# Altium project battery_protection.PrjPcb
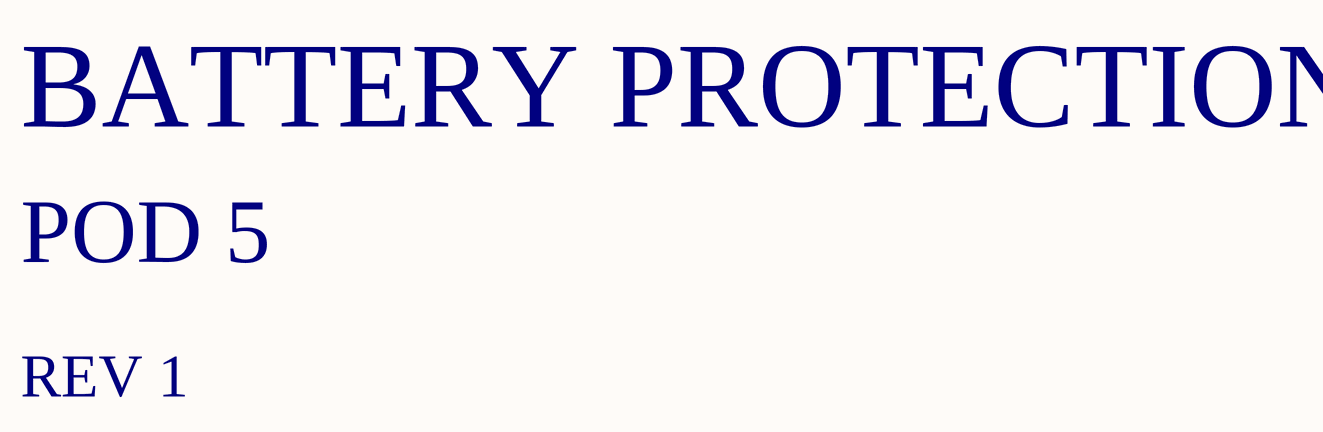
[diagram p0: battery_protection.SchDoc]
4 sheets, 24 parts. Net scope: global (net labels, ports and power ports of the same name join across sheets).
Board file: battery_protection.PcbDoc
Sheets:
  battery_protection.SchDoc
  connectors.SchDoc
  fuse.SchDoc
  cell_interface.SchDoc

## Sheet battery_protection.SchDoc: Battery Protection
size A4; Organization: Badgerloop Electrical; Address1: 133 Engineering Research Building; Address2: 1500 Engineering Drive; Address3: Madison, Wi 53706

### Notes on the sheet
- BATTERY PROTECTION
- POD 5
- REV 1
- Title
- Engineer:
- Date:
- Time:
- Revision:
- Sheet
- of
- File:

## Sheet connectors.SchDoc: Connectors
size A4; Organization: Badgerloop Electrical; Address1: 133 Engineering Research Building; Address2: 1500 Engineering Drive; Address3: Madison, Wi 53706
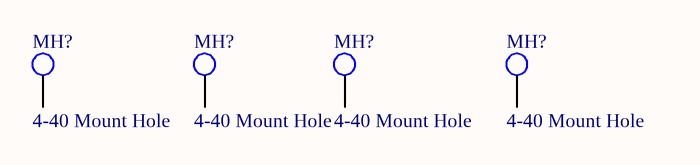
[diagram p1: connectors.SchDoc]

### Parts
(Parts that share a designator on the sheet are numbered #1, #2 ... from top to bottom, then left to right.)
MH?#1  4-40 Mount Hole  [MH]
MH?#2  4-40 Mount Hole  [MH]
MH?#3  4-40 Mount Hole  [MH]
MH?#4  4-40 Mount Hole  [MH]

### Nets

Not connected (* = marked no-connect by the designer): MH?#1 46; MH?#2 46; MH?#3 46; MH?#4 46

### Notes on the sheet
- Title
- Engineer:
- Date:
- Time:
- Revision:
- Sheet
- of
- File:

## Sheet fuse.SchDoc
size A4; Organization: Badgerloop Electrical; Address1: 133 Engineering Research Building; Address2: 1500 Engineering Drive; Address3: Madison, Wi 53706

### Notes on the sheet
- Title
- Engineer:
- Date:
- Time:
- Revision:
- Sheet
- of
- File:

## Sheet cell_interface.SchDoc: Cell Interface
size A4; Organization: Badgerloop; Address1: 133 Engineering Research; Address2: Building; Address3: Madison, WI 53715
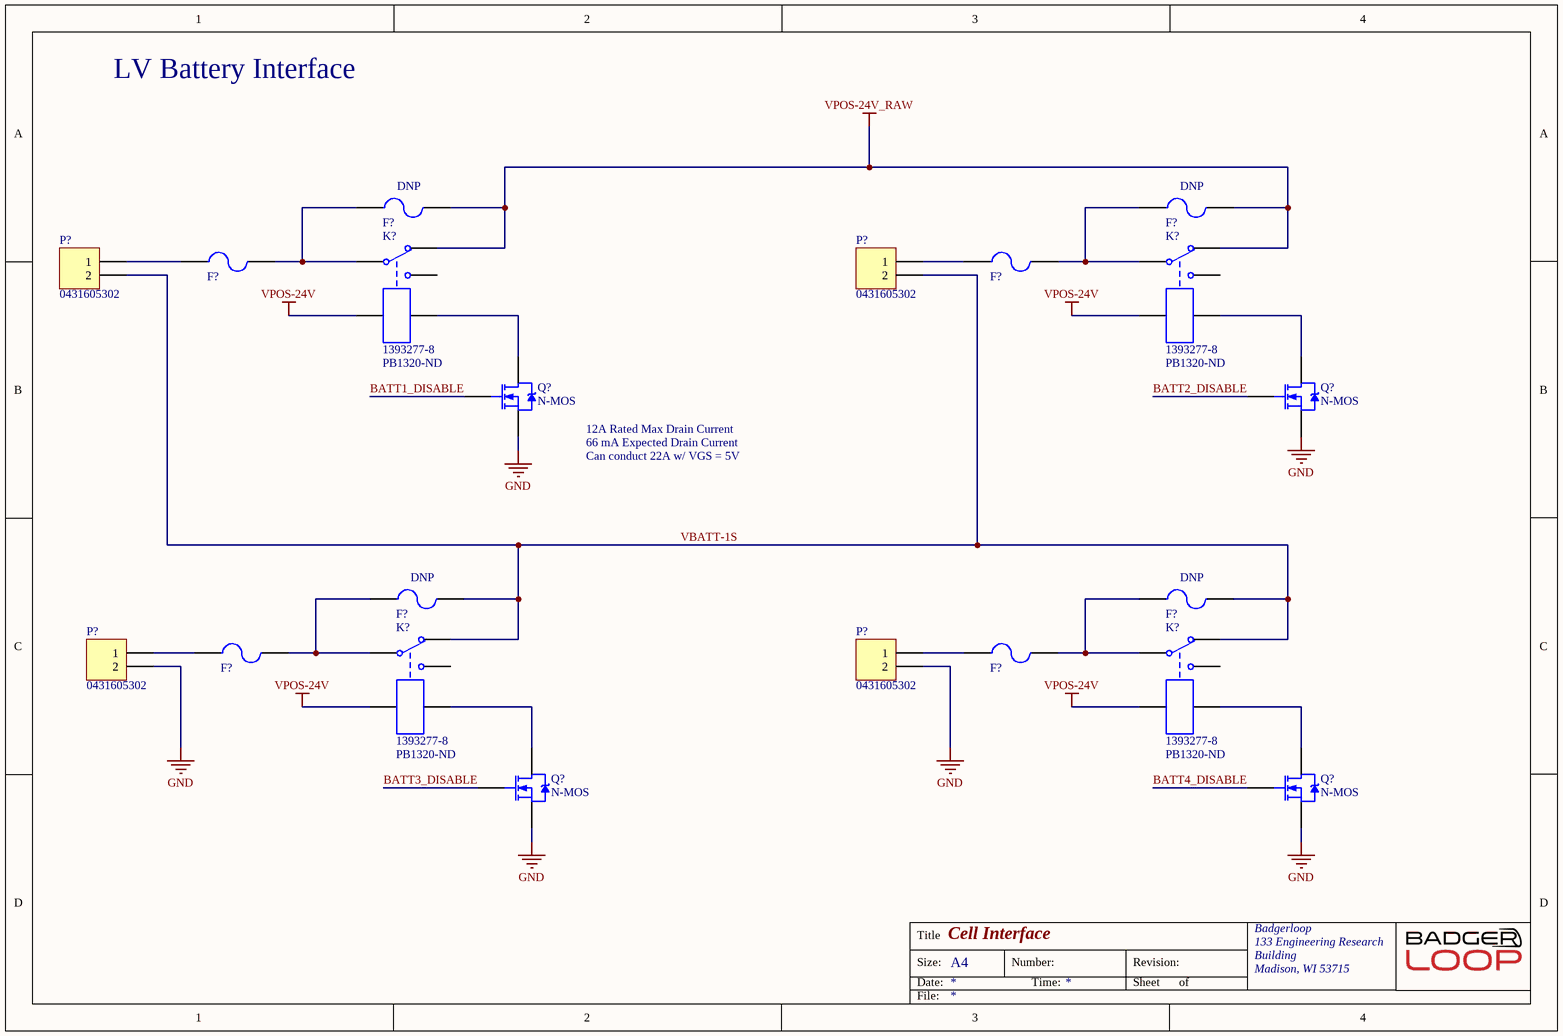
[diagram p2: cell_interface.SchDoc]

### Parts
(Parts that share a designator on the sheet are numbered #1, #2 ... from top to bottom, then left to right.)
F?#1  Do Not Populate: DNP  [Fuse Holder 30A 500V 1 Circuit Blade Through Hole]  (hidden comment: 3568)
F?#2  Do Not Populate: DNP  [Fuse Holder 30A 500V 1 Circuit Blade Through Hole]  (hidden comment: 3568)
F?#3  3568  [Fuse Holder 30A 500V 1 Circuit Blade Through Hole]  (value not drawn)
F?#4  3568  [Fuse Holder 30A 500V 1 Circuit Blade Through Hole]  (value not drawn)
F?#5  Do Not Populate: DNP  [Fuse Holder 30A 500V 1 Circuit Blade Through Hole]  (hidden comment: 3568)
F?#6  Do Not Populate: DNP  [Fuse Holder 30A 500V 1 Circuit Blade Through Hole]  (hidden comment: 3568)
F?#7  3568  [Fuse Holder 30A 500V 1 Circuit Blade Through Hole]  (value not drawn)
F?#8  3568  [Fuse Holder 30A 500V 1 Circuit Blade Through Hole]  (value not drawn)
K?#1  1393277-8  Supplier Part Number 1: PB1320-ND  [RELAY AUTOMOTIVE SPDT 45A 24V - duplicate]
K?#2  1393277-8  Supplier Part Number 1: PB1320-ND  [RELAY AUTOMOTIVE SPDT 45A 24V - duplicate]
K?#3  1393277-8  Supplier Part Number 1: PB1320-ND  [RELAY AUTOMOTIVE SPDT 45A 24V - duplicate]
K?#4  1393277-8  Supplier Part Number 1: PB1320-ND  [RELAY AUTOMOTIVE SPDT 45A 24V - duplicate]
P?#1  0431605302  [CONN HDR 2POS 7.50MM - duplicate]
P?#2  0431605302  [CONN HDR 2POS 7.50MM - duplicate]
P?#3  0431605302  [CONN HDR 2POS 7.50MM - duplicate]
P?#4  0431605302  [CONN HDR 2POS 7.50MM - duplicate]
Q?#1  N-MOS  [DPAK228P991X238-3N]
Q?#2  N-MOS  [DPAK228P991X238-3N]
Q?#3  N-MOS  [DPAK228P991X238-3N]
Q?#4  N-MOS  [DPAK228P991X238-3N]

### Nets
GND: P?#3.2 P?#4.2 Q?#1.3(S) Q?#2.3(S) Q?#3.3(S) Q?#4.3(S)
VPOS-24V: K?#1.1 K?#2.1 K?#3.1 K?#4.1
VPOS-24V_RAW: F?#1.2 F?#2.2 K?#1.3 K?#2.3
BATT1_DISABLE: Q?#1.1(G)
BATT2_DISABLE: Q?#2.1(G)
BATT3_DISABLE: Q?#3.1(G)
BATT4_DISABLE: Q?#4.1(G)
VBATT-1S: F?#5.2 F?#6.2 K?#3.3 K?#4.3 P?#1.2 P?#2.2
NetF?#1_1: F?#1.1 F?#3.2 K?#1.4
NetF?#2_1: F?#2.1 F?#4.2 K?#2.4
NetF?#3_1: F?#3.1 P?#1.1
NetF?#4_1: F?#4.1 P?#2.1
NetF?#5_1: F?#5.1 F?#7.2 K?#3.4
NetF?#6_1: F?#6.1 F?#8.2 K?#4.4
NetF?#7_1: F?#7.1 P?#3.1
NetF?#8_1: F?#8.1 P?#4.1
NetK?#1_2: K?#1.2 Q?#1.4(D)
NetK?#2_2: K?#2.2 Q?#2.4(D)
NetK?#3_2: K?#3.2 Q?#3.4(D)
NetK?#4_2: K?#4.2 Q?#4.4(D)

Not connected (* = marked no-connect by the designer): K?#1 5; K?#2 5; K?#3 5; K?#4 5

### Notes on the sheet
- LV Battery Interface
- 12A Rated Max Drain Current
- 66 mA Expected Drain Current
- Can conduct 22A w/ VGS = 5V
- Title
- Size:
- Date:
- A4
- Number:
- Time:
- Revision:
- Sheet
- of
- File:

### Library data of the parts
F?#1-F?#8 = 3568: FUSE HOLDER MINI AUTO PC; Manufacturer: Keystone Electronics; Material: Brass,Tin,Nylon; Color: Black; Body Material: Nylon; Current Rating: 20A; Voltage Rating (AC): 500V; Number of Poles: 1; Illumination Type: Illuminated; Fuse Type: Automotive; Approvals: UL; Supplier 1: Digi-Key; Manufacturer Part Number: 3568; Stock 1: 0; Mount: PCB,Vertical; Contact Material: Brass,Tin; Contact Plating: Tin; Min Operating Temperature: -50°C; Max Operating Temperature: 145°C; Package Quantity: 1; Termination: PC Pin; Orientation: Vertical; Number of Circuits: 1; Voltage: 500V; Fuse Current: 20A; Length: 16mm; Depth: 6.73mm; Lead Free: Lead Free; REACH SVHC: No SVHC; Flammability Rating: UL94 V-0; ComponentLink1URL: http://www.keyelco.com/userAssets/file/M60-2p40.pdf?src-supplier=Future+Electronics; ComponentLink1Description: http://www.keyelco.com/userAssets/file/M60-2p40.pdf?src-supplier=Future+Electronics; ComponentLink2URL: https://www.alliedelec.com/m/d/15b4f09b8ba48c4b08efedd730709c21.pdf?src-supplier=Allied+Electronics; ComponentLink2Description: https://www.alliedelec.com/m/d/15b4f09b8ba48c4b08efedd730709c21.pdf?src-supplier=Allied+Electronics; Supplier Part Number 1: 3568K-ND
K?#1-K?#4 = 1393277-8: RELAY AUTOMOTIVE SPDT 45A 24V; Manufacturer: TE Connectivity; Coil Current: 66.29mA; Coil Resistance: 362R; Coil Power: 1.6W; Operate Time: 5ms; Number of Contacts: 2; Release Time: 3ms; Coil Type: Non-Latching; Supplier 1: Digi-Key; Manufacturer Part Number: 1393277-8; Stock 1: 2937; Pricing 1: 1=5.39, 10=5.053, 25=4.4912, 50=4.2666, 100=4.042, 250=3.73328 (USD); Mount: Through Hole; Number of Pins: 7; Weight: 22g; Contact Material: Silver; Min Operating Temperature: -40°C; Max Operating Temperature: 105°C; Throw Configuration: SPDT; Coil Voltage (DC): 24V; Termination: PCB; Contact Current Rating: 45A; Current Rating: 45A; Packaging: Bulk; Package Quantity: 525; Relay Type: Relay; Length: 26.1mm; Height: 21.2mm; Depth: 21.1mm; Width: 21.1mm; Radiation Hardening: No; Lead Free: Lead Free; ELV: Compliant; ComponentLink1URL: https://www.verical.com/server-webapp/html/getDatasheet?partID=318318&src-supplier=Verical; ComponentLink1Description: https://www.verical.com/server-webapp/html/getDatasheet?partID=318318&src-supplier=Verical; ComponentLink2URL: https://www.te.com/commerce/DocumentDelivery/DDEController?Action=srchrtrv&DocNm=V23133-X0000-A001&DocType=DS&DocLang=English&src-supplier=Digi-Key; ComponentLink2Description: https://www.te.com/commerce/DocumentDelivery/DDEController?Action=srchrtrv&DocNm=V23133-X0000-A001&DocType=DS&DocLang=English&src-supplier=Digi-Key
P?#1-P?#4 = 0431605302: Conn Power HDR 2 POS 7.49mm Solder RA Thru-Hole 4 Terminal 1 Port Sabre™ Tray; Manufacturer: Molex; Current Rating: 18A; Number of Positions: 2; Voltage Rating: 600V; Number of Ports: 1; Contact Resistance: 30mR; Supplier 1: Digi-Key; Manufacturer Part Number: 0431605302; Stock 1: 0; Mount: Through Hole; Housing Material: Nylon; Contact Material: Brass; Contact Plating: Tin,Copper; Color: Black; Insulation Material: Nylon; Number of Terminals: 4; Housing Color: Black; Min Operating Temperature: -40°C; Max Operating Temperature: 75°C; Number of Rows: 1; Packaging: Tray; Package Quantity: 525; Termination: Solder; Number of Contacts: 2; Orientation: Right Angle; Fastening Type: Ramp; Length: 21.08mm; Pitch: 7.49mm; Depth: 19.79mm; ComponentLink1URL: https://www.verical.com/server-webapp/html/getDatasheet?partID=198412&src-supplier=Verical; ComponentLink1Description: https://www.verical.com/server-webapp/html/getDatasheet?partID=198412&src-supplier=Verical; ComponentLink2URL: http://components.arrow.com/part/dataview/2942820S6220968N3303?src-supplier=Arrow; ComponentLink2Description: http://components.arrow.com/part/dataview/2942820S6220968N3303?src-supplier=Arrow; ComponentLink3URL: http://www.molex.com/pdm_docs/ps/PSX-43335-9999.pdf?src-supplier=Digi-Key; ComponentLink3Description: http://www.molex.com/pdm_docs/ps/PSX-43335-9999.pdf?src-supplier=Digi-Key; Supplier Part Number 1: WM13983-ND
Q?#1-Q?#4 = N-MOS: N-Channel Power MOSFET, 12 A, 60 V; Manufacturer: ON SEMI; Manufacturer P/N: NTD3055L104T4G; Digikey Link: https://www.digikey.com/product-detail/en/on-semiconductor/NTD3055L104T4G/NTD3055L104T4GOSDKR-ND/1749196; Digikey P/N: NTD3055L104T4GOSDKR-ND